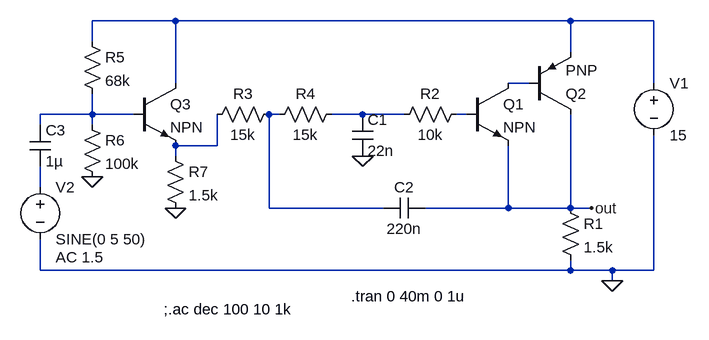
[diagram p0: schematic lp.asc]
lp.asc, the LTspice schematic file:
Version 4
SHEET 1 880 680
WIRE -272 -48 -400 -48
WIRE 336 -48 -272 -48
WIRE 464 -48 336 -48
WIRE -400 -16 -400 -48
WIRE 336 0 336 -48
WIRE -272 48 -272 -48
WIRE 272 48 240 48
WIRE 464 48 464 -48
WIRE -400 96 -400 64
WIRE -400 96 -480 96
WIRE -336 96 -400 96
WIRE -112 96 -128 96
WIRE 16 96 -32 96
WIRE 80 96 16 96
WIRE 176 96 160 96
WIRE -480 112 -480 96
WIRE -400 112 -400 96
WIRE -208 144 -208 96
WIRE -208 144 -272 144
WIRE -272 160 -272 144
WIRE -480 208 -480 176
WIRE -128 240 -128 96
WIRE 48 240 -128 240
WIRE 240 240 240 144
WIRE 240 240 112 240
WIRE 336 240 336 96
WIRE 336 240 240 240
WIRE 368 240 336 240
WIRE -480 336 -480 288
WIRE 336 336 336 320
WIRE 336 336 -480 336
WIRE 400 336 336 336
WIRE 464 336 464 128
WIRE 464 336 400 336
WIRE 400 352 400 336
FLAG 400 352 0
FLAG 368 240 out
FLAG 16 160 0
FLAG -400 192 0
FLAG -272 240 0
SYMBOL npn 176 48 R0
SYMATTR InstName Q1
SYMBOL pnp 272 96 M180
SYMATTR InstName Q2
SYMBOL voltage 464 32 R0
WINDOW 123 0 0 Left 0
WINDOW 39 0 0 Left 0
SYMATTR InstName V1
SYMATTR Value 15
SYMBOL res 320 224 R0
SYMATTR InstName R1
SYMATTR Value 1.5k
SYMBOL voltage -480 192 R0
WINDOW 123 24 124 Left 2
WINDOW 39 0 0 Left 0
SYMATTR InstName V2
SYMATTR Value SINE(0 5 50)
SYMATTR Value2 AC 1.5
SYMBOL res 176 80 R90
WINDOW 0 0 56 VBottom 2
WINDOW 3 32 56 VTop 2
SYMATTR InstName R2
SYMATTR Value 10k
SYMBOL res -112 80 R90
WINDOW 0 0 56 VBottom 2
WINDOW 3 32 56 VTop 2
SYMATTR InstName R3
SYMATTR Value 15k
SYMBOL res -16 80 R90
WINDOW 0 0 56 VBottom 2
WINDOW 3 32 56 VTop 2
SYMATTR InstName R4
SYMATTR Value 15k
SYMBOL cap 0 96 R0
SYMATTR InstName C1
SYMATTR Value 22n
SYMBOL cap 112 224 R90
WINDOW 0 0 32 VBottom 2
WINDOW 3 32 32 VTop 2
SYMATTR InstName C2
SYMATTR Value 220n
SYMBOL res -416 -32 R0
SYMATTR InstName R5
SYMATTR Value 68k
SYMBOL res -416 96 R0
SYMATTR InstName R6
SYMATTR Value 100k
SYMBOL npn -336 48 R0
SYMATTR InstName Q3
SYMBOL res -288 144 R0
SYMATTR InstName R7
SYMATTR Value 1.5k
SYMBOL cap -496 112 R0
SYMATTR InstName C3
SYMATTR Value 1µ
TEXT -2 376 Left 2 !.tran 0 40m 0 1u
TEXT -290 396 Left 2 !;.ac dec 100 10 1k

The netlist it stands for:
* lp.asc
Q1 N002 N006 out 0 NPN
Q2 out N002 N001 0 PNP
V1 N001 0 15
R1 out 0 1.5k
V2 N008 0 SINE(0 5 50) AC 1.5
R2 N006 N005 10k
R3 N004 N007 15k
R4 N005 N004 15k
C1 N005 0 22n
C2 out N004 220n
R5 N001 N003 68k
R6 N003 0 100k
Q3 N001 N003 N007 0 NPN
R7 N007 0 1.5k
C3 N003 N008 1µ
.model NPN NPN
.model PNP PNP
.lib standard.bjt
.tran 0 40m 0 1u
;.ac dec 100 10 1k
.backanno
.end